# EAGLE design ik_dragonfly (EAGLE 7.1.0)
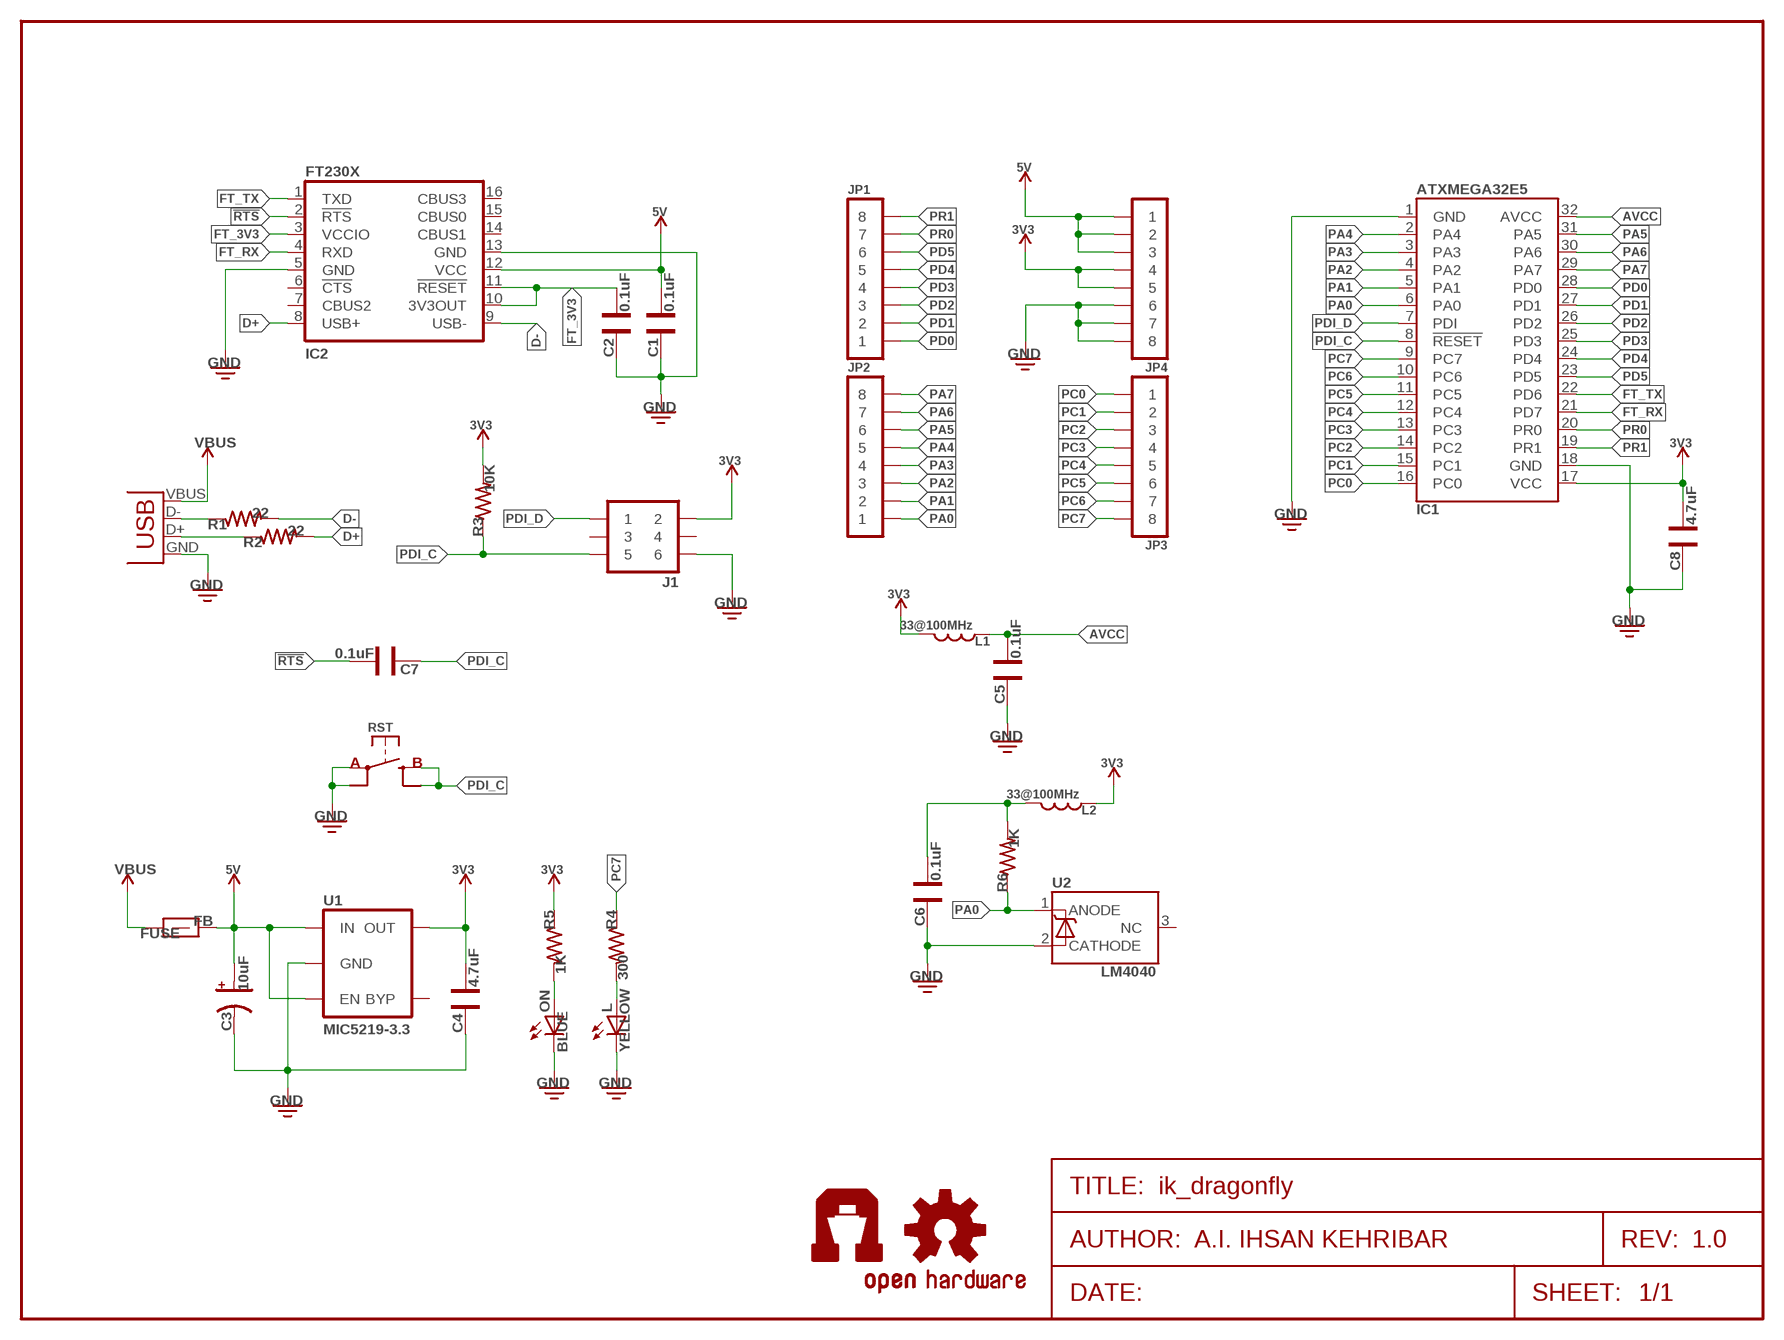
[diagram p0: schematic, sheet 1]
FRAME1 (FRAME-LETTER): AUTHOR: A.I. IHSAN KEHRIBAR; REV: 1.0

## Parts
C1  0.1uF  CAP0603  [CAP-0603]
C2  0.1uF  CAP0603  [CAP-0603]
C3  10uF  CAP-POLEIA3216  [CAP-POL-EIA3216]
C4  4.7uF  CAP0603  [CAP-0603]
C5  0.1uF  CAP0603  [CAP-0603]
C6  0.1uF  CAP0603  [CAP-0603]
C7  0.1uF  CAP0603  [CAP-0603]
C8  4.7uF  CAP0603  [CAP-0603]
FUSE  FB  [FB-0603]
IC1  ATXMEGA32E5  [TQFP32-08]
IC2  FT230X  [SSOP-16-FTDI]
J1  2X03  [2X03]
JP1  1X08NOFIRST  [1X08-NOFIRST]
JP2  1X08NOFIRST  [1X08-NOFIRST]
JP3  1X08NOFIRST  [1X08-NOFIRST]
JP4  1X08NOFIRST  [1X08-NOFIRST]
L  YELLOW  LED0603  [LED-0603]
L1  33@100MHz  IND0603  [IND-0603]
L2  33@100MHz  IND0603  [IND-0603]
LOGO1  OSHW-LOGOS  [OSHW-LOGO-S]
ON  BLUE  LED0603  [LED-0603]
R1  22  RES0603  [RES-0603]
R2  22  RES0603  [RES-0603]
R3  10K  RES0603  [RES-0603]
R4  300  RES0603  [RES-0603]
R5  1K  RES0603  [RES-0603]
R6  1K  RES0603  [RES-0603]
RST  SW-SPSTSMD035X030  [SW-SPST-SMD035X030]
U1  MIC5219-3.3  [SOT23-5]
U2  LM4040  [SOT23-3]
U$3  AI-LOGOXS  [AI-LOGO-XS]
USB1  USBMICROB-TH  [USB-MICROB-TH]

## Nets
3V3: C4.1 C8.1 IC1.17(VCC) J1.2 JP4.4 JP4.5 L1.1 L2.2 R3.2 R5.1 U1.5(OUT)
5V: C1.1 C3.A FUSE.2 IC2.12(VCC) JP4.1 JP4.2 JP4.3 U1.1(IN) U1.3(EN)
!RTS: C7.1 IC2.2(!RTS)
AVCC: C5.1 IC1.32(AVCC) L1.2
D+: IC2.8(USB+) R2.2
D-: IC2.9(USB-) R1.2
FT_3V3: C2.1 IC2.3(VCCIO) IC2.10(3V3OUT) IC2.11(!RESET)
FT_RX: IC1.21(PD7) IC2.4(RXD)
FT_TX: IC1.22(PD6) IC2.1(TXD)
GND: C1.2 C2.2 C3.C C4.2 C5.2 C6.2 C8.2 IC1.1(GND) IC1.18(GND) IC2.5(GND) IC2.13(GND) J1.6 JP4.6 JP4.7 JP4.8 L.C ON.C RST.1(A) RST.2(A) U1.2(GND) U2.2(CATHODE) USB1.GND
N$1: R1.1 USB1.D-
N$2: R2.1 USB1.D+
N$3: L.A R4.2
N$8: ON.A R5.2
N$9: C6.1 L2.1 R6.2
PA0: IC1.6(PA0) JP2.1 R6.1 U2.1(ANODE)
PA1: IC1.5(PA1) JP2.2
PA2: IC1.4(PA2) JP2.3
PA3: IC1.3(PA3) JP2.4
PA4: IC1.2(PA4) JP2.5
PA5: IC1.31(PA5) JP2.6
PA6: IC1.30(PA6) JP2.7
PA7: IC1.29(PA7) JP2.8
PC0: IC1.16(PC0) JP3.1
PC1: IC1.15(PC1) JP3.2
PC2: IC1.14(PC2) JP3.3
PC3: IC1.13(PC3) JP3.4
PC4: IC1.12(PC4) JP3.5
PC5: IC1.11(PC5) JP3.6
PC6: IC1.10(PC6) JP3.7
PC7: IC1.9(PC7) JP3.8 R4.1
PD0: IC1.28(PD0) JP1.1
PD1: IC1.27(PD1) JP1.2
PD2: IC1.26(PD2) JP1.3
PD3: IC1.25(PD3) JP1.4
PD4: IC1.24(PD4) JP1.5
PD5: IC1.23(PD5) JP1.6
PDI_C: C7.2 IC1.8(!RESET) J1.5 R3.1 RST.3(B) RST.4(B)
PDI_D: IC1.7(PDI) J1.1
PR0: IC1.20(PR0) JP1.7
PR1: IC1.19(PR1) JP1.8
VBUS: FUSE.1 USB1.VBUS
Unconnected: IC2.6(!CTS) IC2.7(CBUS2) IC2.14(CBUS1) IC2.15(CBUS0) IC2.16(CBUS3) J1.3 J1.4 U1.4(BYP) U2.3(NC)

## Library data of the parts
C1 C2 C4-C8 = Ai_Passives:CAP
C3 = Ai_Passives:CAP-POL: Polarized Capacitor Normally 10uF, 47uF, and 100uF in electrolytic and tantalum varieties.
FUSE = Ai_Passives:FB: Ferrite bead
IC1 = Ai_IC:ATXMEGA32E5
IC2 = Ai_IC:FT230X
J1 = Ai_Connectors:2X03
JP1-JP4 = Ai_Connectors:1X08
L ON = Ai_LED:LED
L1 L2 = Ai_Passives:IND
LOGO1 = Ai_Miscellany:OSHW-LOGO
R1-R6 = Ai_Passives:RES: Part # blah Digikey
RST = Ai_Electromechanical:SW-SPST
U1 = Ai_Power:MIC5219-*: Fixed-Voltage Regulator Standard voltage regulator in SOT23-5 layout. Micrel part MIC5219x.x where x.x designates the output voltage (e.g., 3.3). BYP pin is used to lower output noise with 470pF cap.
U2 = Ai_Power:LM4040
U$3 = Ai_Miscellany:AI-LOGO
USB1 = Ai_Connectors:USB

## Board
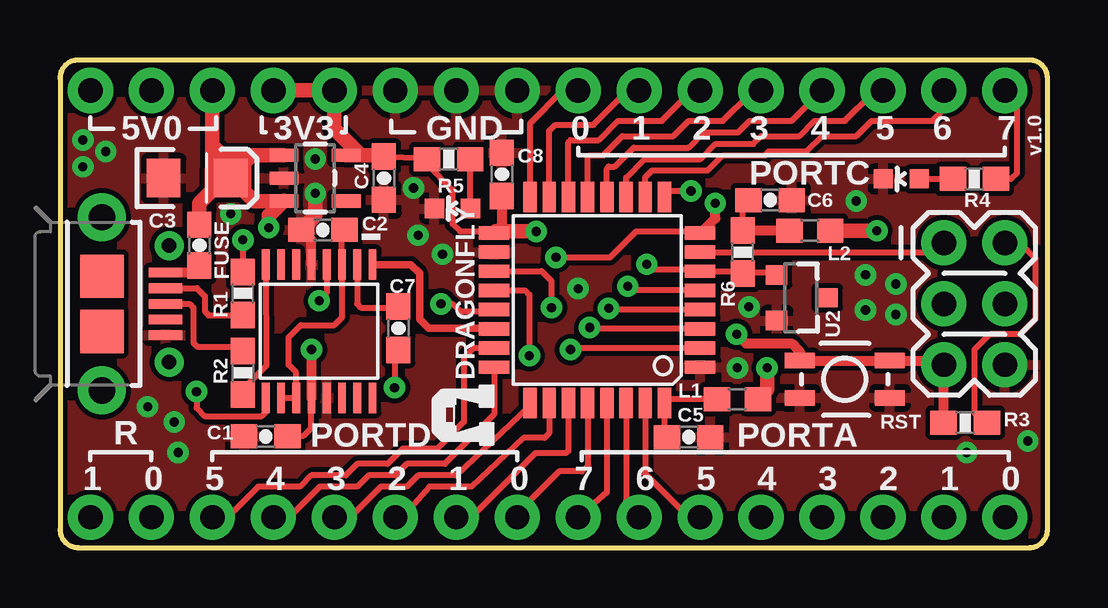
[diagram p1: board, top side]
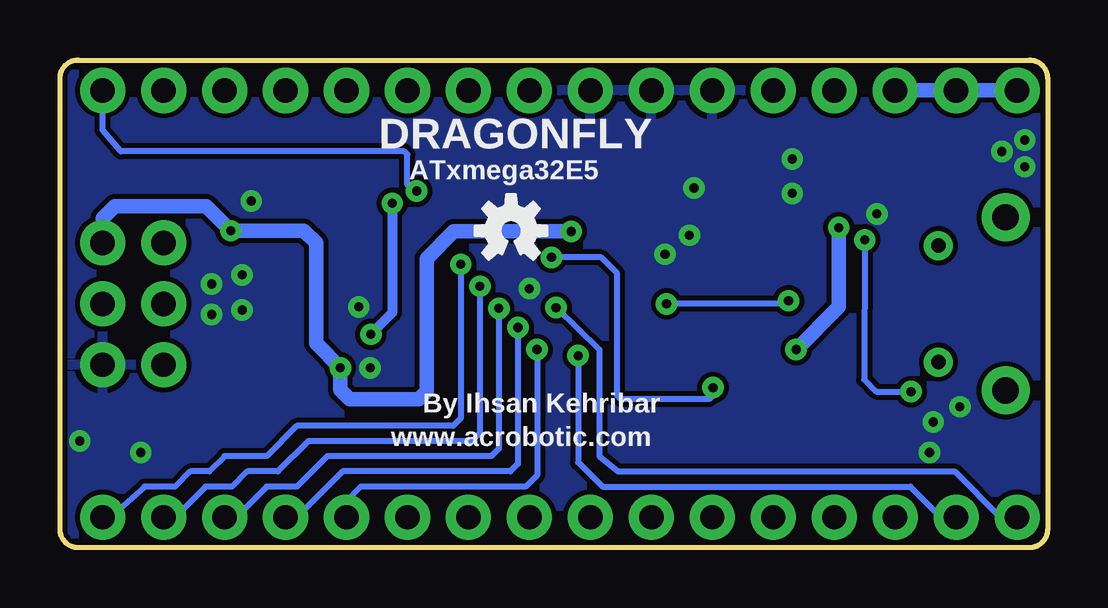
[diagram p2: board, bottom side, seen from below]

Size 41.15 x 20.32 mm. Coordinates in mm from the lower left corner, seen from the top.
Outline: 0,19.56 0,0.76 arc90 0.76,0 40.39,0 arc90 41.15,0.76 41.15,19.56 arc90 40.39,20.32 0.76,20.32 arc90 0,19.56
Copper layers (1*16): Top 0.035mm / dielectric 1.5mm / Bottom 0.035mm
Design rules "ai_2layer": minimum track width 7mil, minimum drill 15mil, track to track 8mil, track to pad 8mil, pad to pad 8mil, via to via 8mil, smd to smd 8mil, copper to edge 8mil, drill to drill 8mil, minimum pad ring 12mil, minimum via ring 10mil, stop-mask expansion 4mil, vias tented up to drill 20mil, thermal gap 10mil

### Footprints (pad centres in the part's own frame; a part is rotated, then mirrored left to right if it is on the bottom)
CAP-0603 = smd 1.1 x 1: 1 -0.9,0; 2 0.9,0
CAP-POL-EIA3216 = smd 1.4 x 1.6: A 1.4,0; C -1.4,0
FB-0603 = smd 1.1 x 1: 1 -0.85,0; 2 0.85,0
TQFP32-08 = smd 1.27 x 0.559: 1 -4.293,2.8; 2 -4.293,2; 3 -4.293,1.2; 4 -4.293,0.4; 5 -4.293,-0.4; 6 -4.293,-1.2; 7 -4.293,-2; 8 -4.293,-2.8; 17 4.293,-2.8; 18 4.293,-2; 19 4.293,-1.2; 20 4.293,-0.4; 21 4.293,0.4; 22 4.293,1.2; 23 4.293,2; 24 4.293,2.8 | smd 0.559 x 1.27: 9 -2.8,-4.293; 10 -2,-4.293; 11 -1.2,-4.293; 12 -0.4,-4.293; 13 0.4,-4.293; 14 1.2,-4.293; 15 2,-4.293; 16 2.8,-4.293; 25 2.8,4.293; 26 2,4.293; 27 1.2,4.293; 28 0.4,4.293; 29 -0.4,4.293; 30 -1.2,4.293; 31 -2,4.293; 32 -2.8,4.293
SSOP-16-FTDI = smd 0.32 x 1.26: 1 -2.223,-2.779; 2 -1.588,-2.779; 3 -0.953,-2.779; 4 -0.318,-2.779; 5 0.317,-2.779; 6 0.952,-2.779; 7 1.587,-2.779; 8 2.222,-2.779; 9 2.222,2.779; 10 1.587,2.779; 11 0.952,2.779; 12 0.317,2.779; 13 -0.318,2.779; 14 -0.953,2.779; 15 -1.588,2.779; 16 -2.223,2.779
2X03 = drill 1.016 pad 1.88: 1 -2.54,-1.27; 2 -2.54,1.27; 3 0,-1.27; 4 0,1.27; 5 2.54,-1.27; 6 2.54,1.27
1X08-NOFIRST = drill 1.016 pad 1.88: 1 -8.89,0; 2 -6.35,0; 3 -3.81,0; 4 -1.27,0; 5 1.27,0; 6 3.81,0; 7 6.35,0; 8 8.89,0
LED-0603 = smd 0.8 x 0.8: A 0,-0.75; C 0,0.75
IND-0603 = smd 1.1 x 1: 1 -0.85,0; 2 0.85,0
RES-0603 = smd 1.1 x 1: 1 -0.9,0; 2 0.9,0
SW-SPST-SMD035X030 = smd 1.25 x 0.65: 1 -1.875,0.775; 2 1.875,0.775; 3 -1.875,-0.775; 4 1.875,-0.775
SOT23-5 = smd 0.55 x 1.2: 1 -0.95,-1.3; 2 0,-1.3; 3 0.95,-1.3; 4 0.95,1.3; 5 -0.95,1.3
SOT23-3 = smd 0.8 x 0.9: 1 -0.95,-1; 2 0.95,-1; 3 0,1.1
USB-MICROB-TH = smd 0.4 x 1.4: D+ 0,2.65; D- -0.65,2.65; GND 1.3,2.65; ID 0.65,2.65; VBUS -1.3,2.65 | smd 1.8 x 1.8: M5 -1.15,0; M6 1.15,0 | drill 0.6 pad 1.2: MT1 -2.425,2.8; MT2 2.425,2.8 | drill 1.1 pad 2: MT3 -3.61,0; MT4 3.61,0

### Placement (x,y rotation side)
C1  8.57,4.64 180 top
C2  10.95,13.24 180 top
C3  5.71,15.4 0 top
C4  13.49,15.4 270 top
C5  26.19,4.6 0 top
C6  29.59,14.48 0 top
C7  14.1,9.14 270 top
C8  18.41,15.56 90 top
FUSE  5.81,12.6 90 top
IC1  22.38,10.32 180 top
IC2  10.79,9.02 180 top
J1  38.1,10.16 270 top
JP1  10.16,1.27 180 top
JP2  30.48,1.27 180 top
JP3  30.48,19.05 0 top
JP4  10.16,19.05 0 top
L  35.05,15.37 90 top
L1  28.23,6.19 180 top
L2  31.24,13.21 0 top
LOGO1  22.35,13.21 0 bottom
ON  16.35,14.13 90 top
R1  7.62,10.59 90 top
R2  7.62,7.29 270 top
R3  37.72,5.21 0 top
R4  38.1,15.37 180 top
R5  16.19,16.19 0 top
R6  28.45,12.32 90 top
RST  32.7,7.02 180 top
U1  10.63,15.4 270 top
U2  30.86,10.41 270 top
U$3  18.16,4.19 90 top
USB1  1.75,10.16 270 top

### Tracks (layer width: path | path; a pad name or v marks a point on that pad's centre or on a via)
3V3  (via drill 0.38)
  Top 0.254: 11.91,16.38 U1.5 | 13.39,16.35 C4.1 15.16,16.25 R5.1 | 39.21,12.7 J1.2 40.01,12.7 40.64,12.06 40.64,9.53 40.01,8.89 38.73,8.89 38.1,8.26 38.1,5.61 R3.2 | R5.1 15.3,16.25 | IC1.17 18.03,13.18 16.67,13.18 16.35,13.49 16.35,14.92 15.34,15.93 R5.1
  Top 0.406: C8.1 18.41,13.44 IC1.17
  Top 0.61: U1.5 12.54,16.35 | 12.54,16.35 13.39,16.35 | v19.84,13.18 18.15,13.18 IC1.17 | v34.04,13.21 L2.2 | 12.54,16.35 11.43,17.46 JP4.5 JP4.4 | L1.1 29.08,6.22 29.46,6.6 v29.46,7.49
  Bottom 0.61: v19.84,13.18 24.73,13.18 25.88,12.03 25.88,6.51 26.19,6.19 L1.1 29.46,6.58 v29.46,7.49 30.48,8.51 30.48,12.7 30.99,13.21 v34.04,13.21 35.05,14.22 38.86,14.22 39.37,13.72 J1.2
5V  (via drill 0.38)
  Top 0.254: C1.1 10.16,4.67 10.48,4.99 IC2.12
  Top 0.406: v10.48,8.26 IC2.12
  Top 0.61: v8.7,13.34 8.7,13.85 8.73,13.85 U1.3 8.08,14.44 7.67,14.85 | JP4.3 6.35,16.76 | 6.35,16.76 6.76,16.35 U1.1 7.99,16.35 7.67,16.03 7.67,14.85 | 6.35,16.76 6.33,14.87 5.81,14.35 FUSE.2 | 7.67,14.85 7.66,14.85 C3.A
  Bottom 0.61: v8.7,13.34 8.7,10.03 v10.48,8.26 | JP4.1 JP4.2 JP4.3
!RTS
  Top 0.254: IC2.2 12.38,10.16 12.54,10 14.07,10 C7.1
AVCC
  Top 0.254: C5.1 25.18,4.76 IC1.32 25.35,6.19 L1.2
D+
  Top 0.254: IC2.8 8.6,7.58 7.62,6.6 R2.2
D-  (via drill 0.38)
  Top 0.254: 8.55,6.51 IC2.9 8.57,5.64 8.41,5.49 6.03,5.49 5.69,5.83 v5.69,6.5 | v7.62,12.83 R1.2
  Bottom 0.254: v7.62,12.83 7.64,7.01 7.14,6.5 v5.69,6.5
FT_3V3
  Top 0.203: 11.75,9.59 11.68,9.53
  Top 0.254: IC2.10 IC2.11 9.84,7.3 9.53,7.62 9.53,8.76 10.03,9.27 11.43,9.27 11.68,9.53 | C2.1 11.75,13.12 IC2.3 11.75,9.59
FT_RX  (via drill 0.38)
  Top 0.254: IC2.4 11.11,10.6 v10.79,10.29 | IC1.21 18.02,9.84 16.67,9.84 16.35,10.16 v15.88,10.16
  Bottom 0.254: v10.79,10.29 10.92,10.16 v15.88,10.16
FT_TX
  Top 0.305: IC2.1 14.62,11.8 14.99,11.43 14.99,9.53 15.37,9.14 18.07,9.14 IC1.22
GND  (via drill 0.38)
  Top 0.406: IC2.5 10.48,12.82 C2.2
  Top 0.61: v10.64,14.76 10.64,13.82 C2.2
  other vias: 10.64,16.19 7.11,13.91 0.95,16.99 0.95,15.88 1.91,16.51 28.7,10.03 28.23,7.49 37.78,3.97 15.94,12.22 33.18,14.45 21.59,10.79 3.65,5.87 4.76,5.24 4.92,3.97 14.92,13.02 14.73,14.99 33.56,11.37 34.83,10.99 33.56,9.91 34.83,9.72 40.32,4.45
  pour Top: 0,0 41.15,0 41.15,20.32 0,20.32
  pour Bottom: 0,0 41.15,0 41.15,20.32 0,20.32
N$1
  Top 0.254: USB1.D- 5.7,10.81 6.03,10.48 6.03,9.84 6.19,9.68 7.25,9.68 R1.1
N$2
  Top 0.254: USB1.D+ 5.4,10.16 5.56,10 5.56,8.54 5.71,8.38 7.36,8.38 7.55,8.19 R2.1 7.25,8.26
N$3
  Top 0.254: L.A R4.2
N$8
  Top 0.254: ON.A 17.1,16.13 R5.2
N$9
  Top 0.254: R6.2 28.45,14.19 C6.1
  Top 0.406: R6.2 L2.1
PA0  (via drill 0.38)
  Top 0.254: U2.1 29.69,11.46 28.45,11.46 R6.1 28.4,11.52 IC1.6 26.61,11.59 24.67,11.59 v24.45,11.81
  Bottom 0.254: v24.45,11.81 24.45,5.4 24.77,5.08 31.27,5.08 32.54,3.81 34.29,3.81 34.92,3.17 35.72,3.17 36.35,2.54 37.62,2.54 39.05,1.27 JP2.1
PA1  (via drill 0.38)
  Top 0.254: IC1.5 23.86,10.72 v23.65,10.89
  Bottom 0.254: v23.65,10.89 23.65,4.76 23.97,4.45 30.8,4.45 32.07,3.17 33.34,3.17 33.97,2.54 35.08,2.54 36.35,1.27 JP2.2
PA2  (via drill 0.38)
  Top 0.254: IC1.4 22.94,9.92 v22.86,9.97
  Bottom 0.254: v22.86,9.97 22.86,4.13 23.18,3.81 30,3.81 31.27,2.54 32.54,2.54 33.81,1.27 JP2.3
PA3  (via drill 0.38)
  Top 0.254: IC1.3 22.14,9.12 v22.07,9.18
  Bottom 0.254: v22.07,9.18 22.07,3.49 22.38,3.17 29.37,3.17 31.27,1.27 JP2.4
PA4  (via drill 0.38)
  Top 0.254: IC1.2 21.34,8.32 v21.27,8.26
  Bottom 0.254: v21.27,8.26 21.27,3.02 21.75,2.54 28.61,2.54 29.21,1.94 JP2.5
PA5
  Top 0.254: IC1.31 24.38,3.08 26.19,1.27 JP2.6
PA6
  Top 0.254: IC1.30 23.58,1.98 JP2.7
PA7
  Top 0.254: IC1.29 22.78,2.31 JP2.8
PC0
  Top 0.254: IC1.16 19.58,17.68 20.95,19.05 JP3.1
PC1
  Top 0.254: IC1.15 20.38,17.37 20.64,17.62 22.23,17.62 23.65,19.05 JP3.2
PC2
  Top 0.254: IC1.14 21.18,16.9 21.27,16.99 22.45,16.99 23.24,17.78 25.08,17.78 26.35,19.05 JP3.3
PC3
  Top 0.254: IC1.13 21.98,16.27 22.07,16.35 22.64,16.35 23.43,17.14 25.56,17.14 26.19,17.78 27.62,17.78 28.73,18.89 29.05,18.89 JP3.4
PC4
  Top 0.254: IC1.12 22.78,15.8 22.86,15.88 23.11,15.88 23.91,16.67 26.19,16.67 26.83,17.3 28.26,17.3 28.73,17.78 30.48,17.78 JP3.5
PC5
  Top 0.254: IC1.11 23.58,15.42 24.35,16.19 26.67,16.19 27.3,16.83 28.89,16.83 29.21,17.14 30.8,17.14 31.43,17.78 32.7,17.78 33.81,18.89 34.13,18.89 JP3.6
PC6
  Top 0.254: IC1.10 24.38,15.43 24.67,15.72 26.99,15.72 27.62,16.35 29.37,16.35 29.53,16.51 31.11,16.51 31.75,17.14 33.18,17.14 33.81,17.78 36.35,17.78 36.83,18.26 JP3.7
PC7  (via drill 0.38)
  Top 0.254: R4.1 39.62,15.37 39.88,15.62 39.88,18.54 JP3.8 | v26.29,14.86 25.43,14.86 IC1.9
  Bottom 0.254: JP3.8 39.37,17.4 38.61,16.51 26.8,16.51 26.67,16.38 26.67,15.11 26.42,14.86 v26.29,14.86
PD0
  Top 0.254: IC1.28 21.98,3.41 21.75,3.17 20.8,3.17 19.05,1.43 JP1.1
PD1
  Top 0.254: IC1.27 21.18,4.04 21.08,3.94 19.81,3.94 17.14,1.27 JP1.2
PD2
  Top 0.254: JP1.3 14.29,1.27 15.4,2.54 17.14,2.54 19.3,4.57 20.19,4.57 20.38,4.76 IC1.26
PD3
  Top 0.254: IC1.25 19.58,5.93 19.53,5.87 16.51,3.02 14.92,3.02 14.45,2.54 13.37,2.54 12.1,1.27 JP1.4
PD4
  Top 0.254: IC1.24 18.09,5.55 16.03,3.49 14.45,3.49 13.97,3.02 12.86,3.02 12.38,2.54 10.83,2.54 9.56,1.27 JP1.5
PD5
  Top 0.254: IC1.23 17.21,8.32 16.83,7.94 16.83,5.24 15.72,4.13 14.29,4.13 13.65,3.49 12.38,3.49 11.91,3.02 10.48,3.02 10,2.54 8.26,2.54 6.99,1.27 JP1.6
PDI_C  (via drill 0.38)
  Top 0.254: C7.2 14.13,8.1 13.94,7.91 v13.94,6.67 | v20.67,12.1 22.92,12.1 24,13.18 26.62,13.18 IC1.8
  Top 0.305: 26.62,13.18 26.77,13.18
  Top 0.406: v28.19,8.89 28.57,8.51 30.48,8.51 30.83,8.16 RST.4 RST.3 36.66,7.79 J1.5 | 26.77,13.18 27.3,13.72 v27.3,14.35 | R3.1 36.83,7.11 J1.5 | 36.78,7.67 J1.5
  Bottom 0.254: v13.94,6.67 13.94,6.35 14.1,6.19 17.78,6.19 17.94,6.35 17.94,11.43 18.61,12.1 v20.67,12.1
  Bottom 0.406: v27.3,14.35 27.3,9.78 v28.19,8.89
PDI_D
  Top 0.254: IC1.7 36.45,12.32 J1.1
PR0  (via drill 0.38)
  Top 0.254: IC1.20 19.38,10.72 19.56,10.54 v19.56,8
  Bottom 0.254: v19.56,8 19.56,3.56 18.54,2.54 5.71,2.54 4.45,1.27 JP1.7
PR1  (via drill 0.38)
  Top 0.254: IC1.19 20.07,11.52 20.48,11.11 v20.48,10
  Bottom 0.254: v20.48,10 18.67,8.26 18.67,3.81 17.91,3.17 3.87,3.17 1.97,1.27 JP1.8
VBUS
  Top 0.406: FUSE.1 5.52,11.46 USB1.VBUS

### Text on the board
tPlace: 5V0 | 3V3 | GND | 0 | 1 | 2 | 3 | 4 | 5 | 6 | 7 | v1.0 | PORTC | DRAGONFLY | R | PORTD | PORTA | 1 | 0 | 5 | 4 | 3 | 2 | 1 | 0 | 7 | 6 | 5 | 4 | 3 | 2 | 1 | 0
bPlace: DRAGONFLY | ATxmega32E5 | By Ihsan Kehribar | www.acrobotic.com